# Altium schematic sheet MCU_48pin.SchDoc
size A3; Organization: Altium Limited; Address1: L3, 12a Rodborough Rd; Address2: Frenchs Forest; Address3: NSW; Address4: Australia 2086
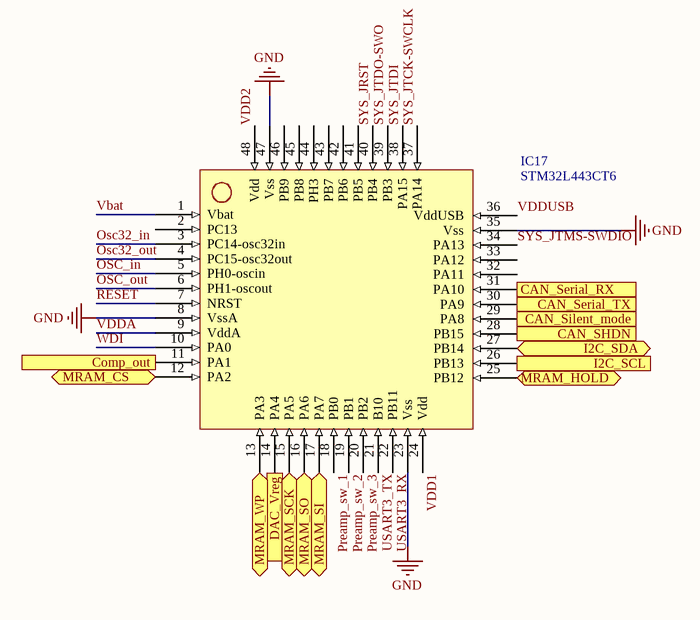
[diagram p0: MCU_48pin.SchDoc]

## Parts
IC17  STM32L443CT6  [LQFP48]

## Ports
CAN_Serial_RX (in), CAN_Serial_TX (out), CAN_SHDN (out), CAN_Silent_mode (out), Comp_out (in), DAC_Vreg (out), I2C_SCL (out), I2C_SDA (bidir), MRAM_CS (bidir), MRAM_HOLD (bidir), MRAM_SCK (bidir), MRAM_SI (bidir), MRAM_SO (bidir), MRAM_WP (bidir)

## Nets
GND: IC17.8(VssA) IC17.23(Vss) IC17.35(Vss) IC17.47(Vss)
CAN_Serial_RX: IC17.31(PA10) ; port CAN_Serial_RX
CAN_Serial_TX: IC17.30(PA9) ; port CAN_Serial_TX
CAN_SHDN: IC17.28(PB15) ; port CAN_SHDN
CAN_Silent_mode: IC17.29(PA8) ; port CAN_Silent_mode
Comp_out: IC17.11(PA1) ; port Comp_out
DAC_Vreg: IC17.14(PA4) ; port DAC_Vreg
I2C_SCL: IC17.26(PB13) ; port I2C_SCL
I2C_SDA: IC17.27(PB14) ; port I2C_SDA
MRAM_CS: IC17.12(PA2) ; port MRAM_CS
MRAM_HOLD: IC17.25(PB12) ; port MRAM_HOLD
MRAM_SCK: IC17.15(PA5) ; port MRAM_SCK
MRAM_SI: IC17.17(PA7) ; port MRAM_SI
MRAM_SO: IC17.16(PA6) ; port MRAM_SO
MRAM_WP: IC17.13(PA3) ; port MRAM_WP
Osc32_in: IC17.3(PC14-osc32in)
Osc32_out: IC17.4(PC15-osc32out)
OSC_in: IC17.5(PH0-oscin)
OSC_out: IC17.6(PH1-oscout)
Preamp_sw_1: IC17.18(PB0)
Preamp_sw_2: IC17.19(PB1)
Preamp_sw_3: IC17.20(PB2)
RESET: IC17.7(NRST)
SYS_JRST: IC17.40(PB4)
SYS_JTCK-SWCLK: IC17.37(PA14)
SYS_JTDI: IC17.38(PA15)
SYS_JTDO-SWO: IC17.39(PB3)
SYS_JTMS-SWDIO: IC17.34(PA13)
USART3_RX: IC17.22(PB11)
USART3_TX: IC17.21(B10)
Vbat: IC17.1(Vbat)
VDD1: IC17.24(Vdd)
VDD2: IC17.48(Vdd)
VDDA: IC17.9(VddA)
VDDUSB: IC17.36(VddUSB)
WDI: IC17.10(PA0)

Not connected (* = marked no-connect by the designer): IC17 2(PC13) 32(PA11) 33(PA12) 41(PB5) 42(PB6) 43(PB7) 44(PH3) 45(PB8) 46(PB9)

## Notes on the sheet
- Title
- Size:
- Date:
- A3
- Number:
- Time:
- Revision:
- Sheet
- of
- File:

## Library data of the parts
IC17 = STM32L443CT: Microcontroller STM32; ComponentLink1Description: New link; ComponentLink1URL: https://il.farnell.com/stmicroelectronics/stm32l443cct6/mcu-32bit-80mhz-lqfp-48/dp/3129670